# EAGLE schematic vco_tom (EAGLE 9.2.2)
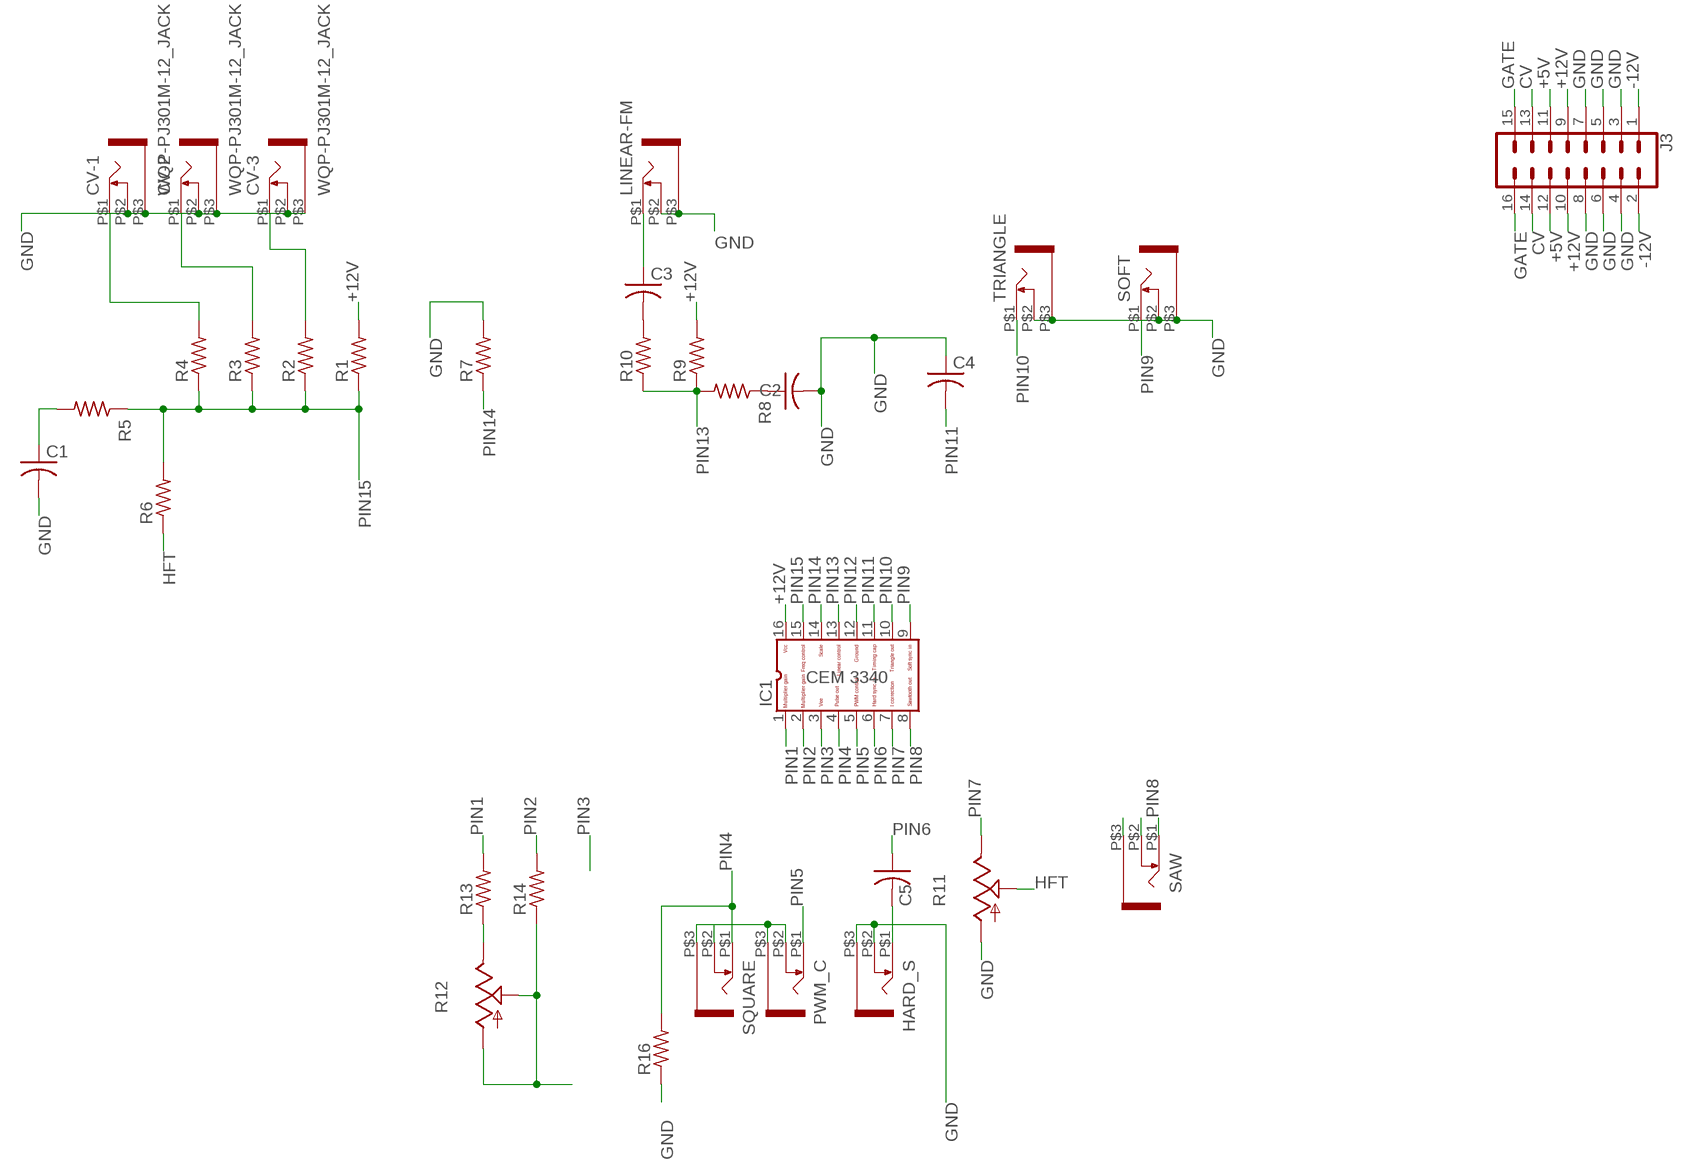
[diagram p0: schematic, sheet 1]

## Parts
C1  C-US050-024X044  [C050-024X044]
C2  C-US050-024X044  [C050-024X044]
C3  C-US050-024X044  [C050-024X044]
C4  C-US050-024X044  [C050-024X044]
C5  C-US050-024X044  [C050-024X044]
CV-1  WQP-PJ301M-12_JACK  [WQP-PJ301M-12_JACK]
CV-2  WQP-PJ301M-12_JACK  [WQP-PJ301M-12_JACK]
CV-3  WQP-PJ301M-12_JACK  [WQP-PJ301M-12_JACK]
HARD_S  WQP-PJ301M-12_JACK  [WQP-PJ301M-12_JACK]
IC1  CEM3340  [DIL16]
J3  CONN_08X2_SHROUD  [2X8-SHROUDED_LOCK]
LINEAR-FM  WQP-PJ301M-12_JACK  [WQP-PJ301M-12_JACK]
PWM_C  WQP-PJ301M-12_JACK  [WQP-PJ301M-12_JACK]
R1  R-US_0207/10  [0207/10]
R2  R-US_0207/10  [0207/10]
R3  R-US_0207/10  [0207/10]
R4  R-US_0207/10  [0207/10]
R5  R-US_0207/10  [0207/10]
R6  R-US_0207/10  [0207/10]
R7  R-US_0207/10  [0207/10]
R8  R-US_0207/10  [0207/10]
R9  R-US_0207/10  [0207/10]
R10  R-US_0207/10  [0207/10]
R11  TRIM_US-B64Y  [B64Y]
R12  TRIM_US-B64Y  [B64Y]
R13  R-US_0207/10  [0207/10]
R14  R-US_0207/10  [0207/10]
R16  R-US_0207/10  [0207/10]
SAW  WQP-PJ301M-12_JACK  [WQP-PJ301M-12_JACK]
SOFT  WQP-PJ301M-12_JACK  [WQP-PJ301M-12_JACK]
SQUARE  WQP-PJ301M-12_JACK  [WQP-PJ301M-12_JACK]
TRIANGLE  WQP-PJ301M-12_JACK  [WQP-PJ301M-12_JACK]

## Nets
+5V: J3.11 J3.12
+12V: IC1.16 J3.9 J3.10 R1.2 R9.2
-12V: J3.1 J3.2
CV: J3.13 J3.14
GATE: J3.15 J3.16
GND: C1.2 C2.2 C4.1 CV-1.P$2 CV-1.P$3 CV-2.P$2 CV-2.P$3 CV-3.P$2 CV-3.P$3 HARD_S.P$2 HARD_S.P$3 J3.3 J3.4 J3.5 J3.6 J3.7 J3.8 LINEAR-FM.P$2 LINEAR-FM.P$3 R7.2 R11.A R16.1 SOFT.P$2 SOFT.P$3 TRIANGLE.P$2 TRIANGLE.P$3
HFT: R6.1 R11.S
N$1: C1.1 R5.2
N$2: C3.2 R10.2
N$3: R12.E R13.1
N$4: C2.1 R8.1
N$5: CV-1.P$1 R4.2
N$6: CV-2.P$1 R3.2
N$7: SAW.P$2
N$8: SAW.P$3
N$9: C3.1 LINEAR-FM.P$1
N$10: CV-3.P$1 R2.2
N$11: R12.A R12.S R14.1
N$12: C5.2 HARD_S.P$1
N$17: SQUARE.P$2
N$19: PWM_C.P$2 PWM_C.P$3 SQUARE.P$3
PIN1: IC1.1 R13.2
PIN2: IC1.2 R14.2
PIN3: IC1.3
PIN4: IC1.4 R16.2 SQUARE.P$1
PIN5: IC1.5 PWM_C.P$1
PIN6: C5.1 IC1.6
PIN7: IC1.7 R11.E
PIN8: IC1.8 SAW.P$1
PIN9: IC1.9 SOFT.P$1
PIN10: IC1.10 TRIANGLE.P$1
PIN11: C4.2 IC1.11
PIN12: IC1.12
PIN13: IC1.13 R8.2 R9.1 R10.1
PIN14: IC1.14 R7.1
PIN15: IC1.15 R1.1 R2.1 R3.1 R4.1 R5.1 R6.2

## Library data of the parts
C1-C5 = rcl:C-US: CAPACITOR, American symbol; SPICEPREFIX: C
CV-1-CV-3 HARD_S LINEAR-FM PWM_C SAW SOFT SQUARE TRIANGLE = thonkiconn:WQP-PJ301M-12_JACK
IC1 = CEM:CEM3340: CEM 3340 VCO
J3 = SparkFun-Connectors:CONN_08X2: Multi connection point. Often used as Generic Header-pin footprint for 0.1 inch spaced/style header connections You can populate with any combo of single row headers, but if you'd like an exact match, check this: Header - 2x8 (Male, 0.1") <https://www.sparkfun.com/products/13156> (PRT-13156) On any of the 0.1 inch spaced packages, you can populate with these: Break Away Headers - Straight <https://www.sparkfun.com/products/116> (PRT-00116) Break Away Male Headers - Right Angle <https://www.sparkfun.com/products/553> (PRT-00553) Female Headers <https://www.sparkfun.com/products/115> (PRT-00115) Break Away Headers - Machine Pin <https://www.sparkfun.com/products/117> (PRT-00117) Break Away Female Headers - Swiss Machine Pin <https://www.sparkfun.com/products/743> (PRT-00743)
R1-R10 R13 R14 R16 = rcl:R-US_: RESISTOR, American symbol; SPICEPREFIX: R
R11 R12 = pot:TRIM_US-: POTENTIOMETER